# Altium project TeaNC.PrjPcb
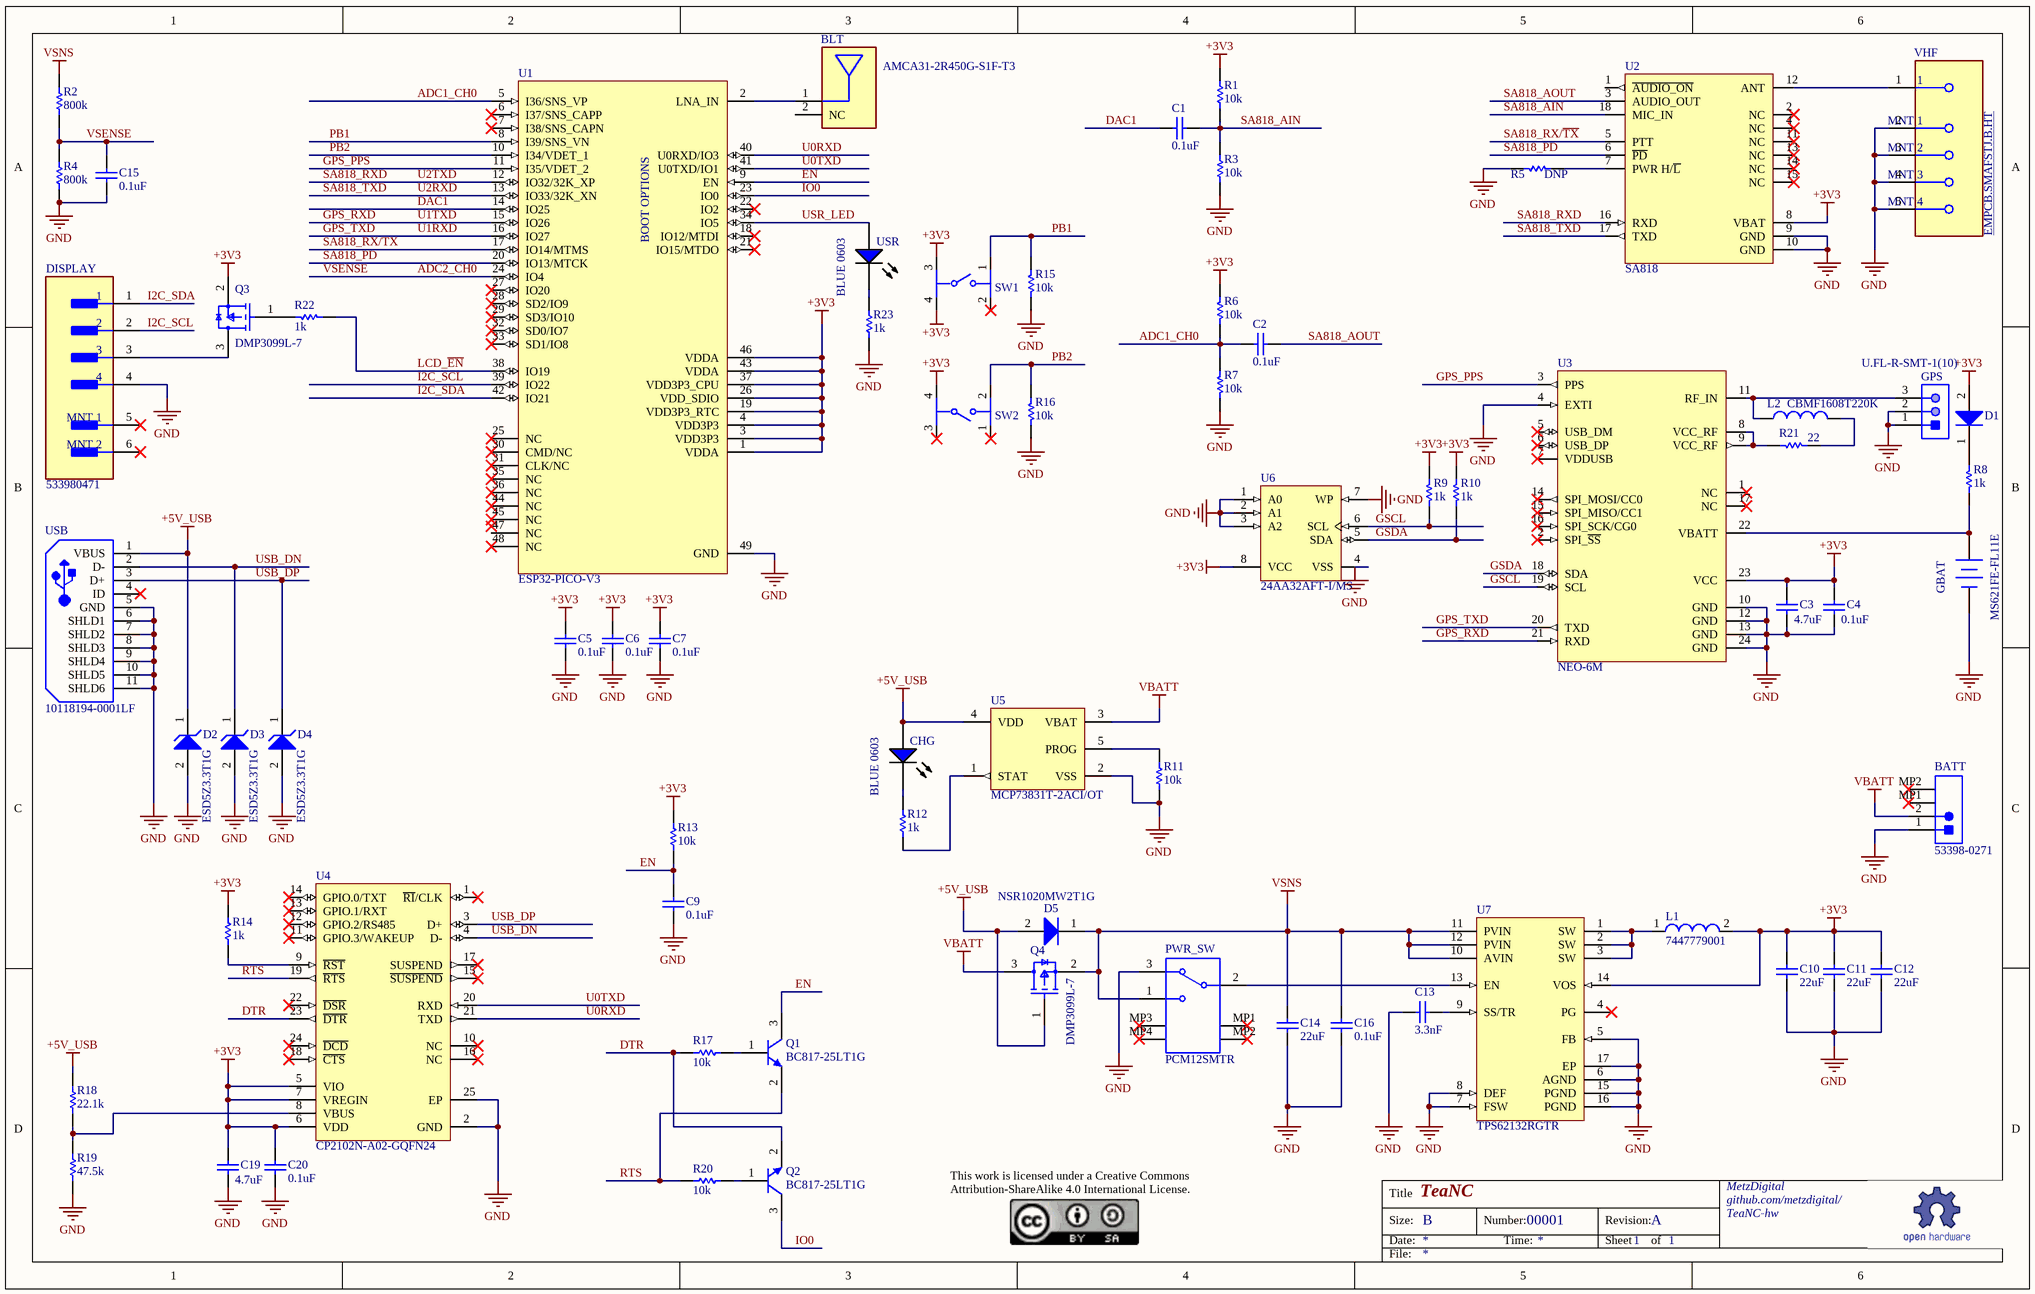
[diagram p0: top.SchDoc]
1 sheet, 70 parts. Net scope: global (net labels, ports and power ports of the same name join across sheets).
Board file: TeaNC.PcbDoc

## Sheet top.SchDoc: TeaNC
size B; Organization: MetzDigital; Address1: github.com/metzdigital/; Address2: TeaNC-hw; DocumentNumber: 00001; Revision: A; SheetNumber: 1; SheetTotal: 1

### Parts
BATT  53398-0271  [MOLX-53398-0271_V]
BLT  AMCA31-2R450G-S1F-T3  [FP-AMCA31-MFG]
C1  0.1uF  [CAPC0603(1608)100_M]
C2  0.1uF  [CAPC0603(1608)100_M]
C3  4.7uF  [CAPC0603(1608)100_M]
C4  0.1uF  [CAPC0603(1608)100_M]
C5  0.1uF  [CAPC0603(1608)100_M]
C6  0.1uF  [CAPC0603(1608)100_M]
C7  0.1uF  [CAPC0603(1608)100_M]
C9  0.1uF  [CAPC0603(1608)100_M]
C10  22uF  [CAPC1206(3216)190_M]
C11  22uF  [CAPC1206(3216)190_M]
C12  22uF  [CAPC1206(3216)190_M]
C13  3.3nF  [CAPC0603(1608)100_M]
C14  22uF  [CAPC1206(3216)190_M]
C15  0.1uF  [CAPC0603(1608)100_M]
C16  0.1uF  [CAPC0603(1608)100_M]
C19  4.7uF  [CAPC0603(1608)100_M]
C20  0.1uF  [CAPC0603(1608)100_M]
CHG  BLUE 0603  [VISH-TLMX1100-2_V]
D1  NSR1020MW2T1G  [ONSC-SOD-323-2-477-02_V]  (value not drawn)
D2  ESD5Z3.3T1G  [ONSC-SOD-523-2-502-01_V]
D3  ESD5Z3.3T1G  [ONSC-SOD-523-2-502-01_V]
D4  ESD5Z3.3T1G  [ONSC-SOD-523-2-502-01_V]
D5  NSR1020MW2T1G  [ONSC-SOD-323-2-477-02_V]
DISPLAY  533980471  [FP-533980471-MFG]
GBAT  MS621FE-FL11E  [SEIK-MS621FE-FL11E-2_V]
GPS  U.FL-R-SMT-1(10)  [HRS-U.FL-R-SMT-1(10)_V]
L1  7447779001  [WE-PD-M-PB]
L2  CBMF1608T220K  [INDC1608X90X30LL10T20]
PWR_SW  PCM12SMTR  [CKCP-PCM12SMTR_V]
Q1  BC817-25LT1G  [ONSC-SOT-23-3-318-08_V]
Q2  BC817-25LT1G  [ONSC-SOT-23-3-318-08_V]
Q3  DMP3099L-7  [FP-SOT23-MFG]
Q4  DMP3099L-7  [FP-SOT23-MFG]
R1  10k  [RESC1609X55X30LL15T15]
R2  800k  [RESC1609X55X30LL15T15]
R3  10k  [RESC1609X55X30LL15T15]
R4  800k  [RESC1609X55X30LL15T15]
R5  DNP  [RESC1609X55X30LL15T15]
R6  10k  [RESC1609X55X30LL15T15]
R7  10k  [RESC1609X55X30LL15T15]
R8  1k  [RESC1609X55X30LL15T15]
R9  1k  [RESC1609X55X30LL15T15]
R10  1k  [RESC1609X55X30LL15T15]
R11  10k  [RESC1609X55X30LL15T15]
R12  1k  [RESC1609X55X30LL15T15]
R13  10k  [RESC1609X55X30LL15T15]
R14  1k  [RESC1609X55X30LL15T15]
R15  10k  [RESC1609X55X30LL15T15]
R16  10k  [RESC1609X55X30LL15T15]
R17  10k  [RESC1609X55X30LL15T15]
R18  22.1k  [RESC1609X55X30LL15T15]
R19  47.5k  [RESC1609X55X30LL15T15]
R20  10k  [RESC1609X55X30LL15T15]
R21  22  [RESC1609X55X30LL15T15]
R22  1k  [RESC1609X55X30LL15T15]
R23  1k  [RESC1609X55X30LL15T15]
SW1  PTS840 GKP SMTR LFS  [FP-PTS840_GKP_SMTR_LFS-MFG]  (value not drawn)
SW2  PTS840 GKP SMTR LFS  [FP-PTS840_GKP_SMTR_LFS-MFG]  (value not drawn)
U1  ESP32-PICO-V3  [QFN_M 48 POS]
U2  SA818  [SA818]
U3  NEO-6M  [NEO-6M]
U4  CP2102N-A02-GQFN24  [SLAB-QFN-24-2550x2550TP_A_V]
U5  MCP73831T-2ACI/OT  [SOT-23-OT5_M]
U6  24AA32AFT-I/MS  [MSOP-MS8_N]
U7  TPS62132RGTR  [RGT0016C_V]
USB  10118194-0001LF  [FCI-10118194-0001LF-5_V]
USR  BLUE 0603  [VISH-TLMX1100-2_V]
VHF  EMPCB.SMAFSTJ.B.HT  [FP-EMPCB_SMAFSTJ_B_HT-MFG]

### Nets
+3V3: C3.2 C4.2 C5.2 C6.2 C7.2 C10.2 C11.2 C12.2 C19.2 C20.2 D1.2(A) L1.2 Q3.2(SOURCE) R1.2 R6.2 R9.2 R10.2 R13.1 R14.1 SW1.3 SW1.4 SW2.4 U1.1(VDDA) U1.3(VDD3P3) U1.4(VDD3P3) U1.19(VDD3P3_RTC) U1.26(VDD_SDIO) U1.37(VDD3P3_CPU) U1.43(VDDA) U1.46(VDDA) U2.8(VBAT) U3.23(VCC) U4.5(VIO) U4.6(VDD) U4.7(VREGIN) U6.8(VCC) U7.14(VOS)
+5V_USB: CHG.1(A) D2.1(K) D5.2(A) Q4.1(GATE) R18.1 U5.4(VDD) USB.1(VBUS)
GND: BATT.1 C3.1 C4.1 C5.1 C6.1 C7.1 C9.1 C10.1 C11.1 C12.1 C13.1 C14.1 C15.1 C16.1 C19.1 C20.1 D2.2(A) D3.2(A) D4.2(A) DISPLAY.4 GBAT.2(-) GPS.1 GPS.2 PWR_SW.3 R3.1 R4.1 R5.2 R7.1 R11.2 R15.1 R16.1 R19.2 R23.2 U1.49(GND) U2.9(GND) U2.10(GND) U3.4(EXTI) U3.10(GND) U3.12(GND) U3.13(GND) U3.24(GND) U4.2(GND) U4.25(EP) U5.2(VSS) U6.1(A0) U6.2(A1) U6.3(A2) U6.4(VSS) U6.7(WP) U7.5(FB) U7.6(AGND) U7.7(FSW) U7.8(DEF) U7.15(PGND) U7.16(PGND) U7.17(EP) USB.5(GND) USB.6(SHLD1) USB.7(SHLD2) USB.8(SHLD3) USB.9(SHLD4) USB.10(SHLD5) USB.11(SHLD6) VHF.2(MNT_1) VHF.3(MNT_2) VHF.4(MNT_3) VHF.5(MNT_4)
VBATT: BATT.2 Q4.3(DRAIN) U5.3(VBAT)
VSNS: C14.2 C16.2 D5.1(K) PWR_SW.1 Q4.2(SOURCE) R2.2 U7.10(AVIN) U7.11(PVIN) U7.12(PVIN)
ADC1_CH0: C2.1 R6.1 R7.2 U1.5(I36/SNS_VP)
ADC2_CH0: C15.2 R2.1 R4.2 U1.24(IO4)  [also labelled VSENSE]
DAC1: C1.2 U1.14(IO25)
DTR: Q2.2(E) R17.2 U4.23(~{DTR})
EN: C9.2 Q1.3(C) R13.2 U1.9(EN)
GPS_PPS: U1.11(I35/VDET_2) U3.3(PPS)
GPS_RXD: U1.15(IO26) U3.21(RXD)  [also labelled U1TXD]
GPS_TXD: U1.16(IO27) U3.20(TXD)  [also labelled U1RXD]
GSCL: R9.1 U3.19(SCL) U6.6(SCL)
GSDA: R10.1 U3.18(SDA) U6.5(SDA)
I2C_SCL: DISPLAY.2 U1.39(IO22)
I2C_SDA: DISPLAY.1 U1.42(IO21)
IO0: Q2.3(C) U1.23(IO0)
LCD_~{EN}: R22.1 U1.38(IO19)
PB1: R15.2 SW1.1 U1.8(I39/SNS_VN)
PB2: R16.2 SW2.2 U1.10(I34/VDET_1)
RTS: Q1.2(E) R20.2 U4.19(~{RTS})
SA818_AIN: C1.1 R1.1 R3.2 U2.18(MIC_IN)
SA818_AOUT: C2.2 U2.3(AUDIO_OUT)
SA818_PD: U1.20(IO13/MTCK) U2.6(~{PD})
SA818_RX/~{TX}: U1.17(IO14/MTMS) U2.5(PTT)
SA818_RXD: U1.12(IO32/32K_XP) U2.16(RXD)  [also labelled U2TXD]
SA818_TXD: U1.13(IO33/32K_XN) U2.17(TXD)  [also labelled U2RXD]
U0RXD: U1.40(U0RXD/IO3) U4.21(TXD)
U0TXD: U1.41(U0TXD/IO1) U4.20(RXD)
USB_DN: D3.1(K) U4.4(D-) USB.2(D-)
USB_DP: D4.1(K) U4.3(D+) USB.3(D+)
USR_LED: U1.34(IO5) USR.1(A)
NetBLT_1: BLT.1(Feed_Point) U1.2(LNA_IN)
NetC13_2: C13.2 U7.9(SS/TR)
NetCHG_2: CHG.2(K) R12.1
NetD1_1: D1.1(K) R8.2
NetDISPLAY_3: DISPLAY.3 Q3.3(DRAIN)
NetGBAT_1: GBAT.1(+) R8.1 U3.22(VBATT)
NetGPS_3: GPS.3 L2.1 U3.11(RF_IN)
NetL1_1: L1.1 U7.1(SW) U7.2(SW) U7.3(SW)
NetL2_2: L2.2 R21.2
NetPWR_SW_2: PWR_SW.2 U7.13(EN)
NetQ1_1: Q1.1(B) R17.1
NetQ2_1: Q2.1(B) R20.1
NetQ3_1: Q3.1(GATE) R22.2
NetR5_1: R5.1 U2.7(PWR_H/~{L})
NetR11_1: R11.1 U5.5(PROG)
NetR12_2: R12.2 U5.1(STAT)
NetR14_2: R14.2 U4.9(~{RST})
NetR18_2: R18.2 R19.1 U4.8(VBUS)
NetR21_1: R21.1 U3.8(VCC_RF) U3.9(VCC_RF)
NetR23_1: R23.1 USR.2(K)
NetU2_12: U2.12(ANT) VHF.1

Not connected (* = marked no-connect by the designer): BATT MP1* MP2*; BLT 2(NC); DISPLAY 5(MNT_1)* 6(MNT_2)*; PWR_SW MP1* MP2* MP3* MP4*; SW1 2*; SW2 1* 3*; U1 6(I37/SNS_CAPP)* 7(I38/SNS_CAPN)* 18(IO12/MTDI)* 21(IO15/MTDO)* 22(IO2)* 25(NC)* 27(IO20)* 28(SD2/IO9)* 29(SD3/IO10)* 30(CMD/NC)* 31(CLK/NC)* 32(SD0/IO7)* 33(SD1/IO8)* 35(NC)* 36(NC)* 44(NC)* 45(NC)* 47(NC) 48(NC)*; U2 1(~{AUDIO_ON}) 2(NC)* 4(NC)* 11(NC)* 13(NC)* 14(NC)* 15(NC)*; U3 1(NC)* 2(SPI_~{SS})* 5(USB_DM)* 6(USB_DP)* 7(VDDUSB)* 14(SPI_MOSI/CC0)* 15(SPI_MISO/CC1)* 16(SPI_SCK/CG0)* 17(NC)*; U4 1(~{RI}/CLK)* 10(NC)* 11(GPIO.3/WAKEUP)* 12(GPIO.2/RS485)* 13(GPIO.1/RXT)* 14(GPIO.0/TXT)* 15(~{SUSPEND})* 16(NC)* 17(SUSPEND)* 18(~{CTS})* 22(~{DSR})* 24(~{DCD})*; U7 4(PG)*; USB 4(ID)*

### Notes on the sheet
- This work is licensed under a Creative Commons Attribution-ShareAlike 4.0 International License.
- Title
- Size:
- Date:
- B
- Number:
- Time:
- Revision:
- Sheet
- of
- File:
- (in symbol ESP32-PICO-V3) BOOT OPTIONS

### Library data of the parts
BATT = CMP-2000-07600-1: Male Header, Pitch 1.25 mm, 1 x 2 Position, Height 4.7 mm, -40 to 85 degC, RoHS, Tape and Reel; Manufacturer: Molex; Voltage Rating: 125V; Glow Wire Compliant: Non-compliant; Pitch: 1.25mm; Number of Positions: 2; Contact Resistance: 20mOhm; Insulation Resistance: 100MOhm; Current Rating: 1A; Mounting Technology: SurfaceMount; Colour: Natural; Mount: SurfaceMount; Termination: Solder; Packaging: TapeandReel; REACH SVHC: Unknown; Voltage Rating (AC): 125V; Housing Colour: Natural; Manufacturer URL: http://www.molex.com/; Max Operating Temperature: 85degC; Gender: Male; Lead Free: LeadFree; RoHSCompliant: True; Contact Plating: Tin; Package Reference: 53398-0271; Contact Material: Tin; Orientation: Vertical; Datasheet URL: http://www.molex.com/pdm_docs/sd/533980271_sd.pdf; Working Voltage: 125V; Flammability Rating: UL94V-0; Number of Contacts: 2; Package Description: Male Header, Pitch 1.25 mm, 1 x 2 Position, Height 4.7 mm; Datasheet Version: Rev. J, 09/2015; Number of Circuits: 2; Number of Rows: 1; Radiation Hardening: No; Voltage Rating (DC): 125V; Min Operating Temperature: -40degC; Housing Material: Nylon; Package Quantity: 1000
BLT = CMP-27836-000002-1: RF ANT 2.4GHZ CHIP SOLDER SMD; Manufacturer: Abracon; Power Rating: 3W; Max Frequency: 2450MHz; Impedance: 50Ω; Number Of Bands: 1; Bandwidth: 100MHz; RoHS: TRUE; ComponentLink2Description: Datasheet; Category: Ant; Temperature: -40°C to +85°C; Device Class L3: RF Antennas; Octopart: https://octopart.com/amca31-2r450g-s1f-t3-abracon-31435383; Manufacturer Part Number: AMCA31-2R450G-S1F-T3; Digikey Description: RF ANT 2.4GHZ CHIP SOLDER SMD; Package: AMCA31; Temperature Range High: +85°C; Automotive: No; Device Class L2: RF Semiconductors and Devices; ComponentLink2URL: https://abracon.com/chip-antenna/AMCA31-2R450G-S1F-T3.pdf; Temperature Range Low: -40°C; Device Class L1: Integrated Circuits (ICs); Lead Free: Yes; Height: 1.4mm; Mouser Description: Antennas 2.45GHz BW 90dB + Gain -1 dBi avg.
C1-C7 C9 C13 C15 C16 C19 C20 = CMP-1035-02593-1: CAP 100nF 50V ±20% 0603 (1608 Metric) Thickness 1mm SMD; Tolerance: Â±20%; Case-EIA: 0603; Case-Metric: 1608; Max Thickness: 1 mm; Value: 100nF; Technology: SMT; Rated Voltage: 50 V
C10-C12 C14 = CMP-1037-04728-1: CAP 1uF 100V ±10% 1206 (3216 Metric) Thickness 1.9mm SMD; Case-EIA: 1206; Case-Metric: 3216; Tolerance: Â±10%; Value: 1uF; Rated Voltage: 100 V; Technology: SMT; Max Thickness: 1.9 mm
CHG USR = CMP-1666-00028-1: Blue LED, 10 mA, 3.9 V, -40 to 100 degC, 2-Pin SMD (0603), RoHS, Tape and Reel; Tolerance: 10%; Voltage Rating: 100 V; Capacitance: 10 nF; Type (Capacitors): X7R; Case\Package: Radial; ComponentLink1Description: Manufacturer URL; REACH SVHC: No SVHC; Package Quantity: 500; PackageDescription: 2-Pin Surface Mount Device, Body 1.6 x 0.8 mm; Pins: 2; ComponentLink2URL: http://download.siliconexpert.com/pdfs/2016/8/7/12/43/26/667/vsh_/manual/379263299541529tlmb1100.pdf; RoHSCompliant: true; Lead Pitch: 2.54 mm; Height: 2.54 mm; DatasheetVersion: Rev. 2.7, 03/2016; Length: 5.33 mm; ComponentLink1URL: http://www.vishay.com/; Min Operating Temperature: -55 degC; PackageReference: 0603; Packaging: Bulk; ComponentLink2Description: Datasheet; Max Operating Temperature: 125 degC; Radiation Hardening: No; Width: 3.81 mm; Mount: Through Hole
D1 D5 = CMP-1055-00471-1: Schottky Barrier Diode, 2-Pin SOD-323, Pb-Free, Tape and Reel; Manufacturer: On Semiconductor; IFSM Max (A): 5; Configuration: Single; ComponentLink2URL: http://www.onsemi.cn/pub_link/Collateral/NSR1020MW2T1-D.PDF; PackageDescription: 2-Pin SOD, Body 1.7 x 1.25 mm; ComponentLink3Description: Package Specification; RoHS: TRUE; PackageReference: SOD-323-2-477-02; PackageVersion: Rev. H, 03/2007; Mounting Technology: Surface Mount; DatasheetVersion: Rev. 1; ComponentLink1URL: http://www.onsemi.com/; PartNumber: NSR1020MW2T1G; Packing: Tape and Reel; ComponentLink1Description: Manufacturer URL; ComponentLink2Description: Datasheet; ComponentLink3URL: http://www.onsemi.com/pub_link/Collateral/477-02.PDF.1
D2-D4 = CMP-1063-00098-1: Transient Voltage Suppressor, Micro-Packaged Diode for ESD Protection, 2-Pin SOD-523, Pb-Free, Tape and Reel; Manufacturer: On Semiconductor; VRWM Max (V): 3.3; Number of Lines: 1; V(BR) Min (V): 5; PPK Max (W): 158; Direction: Unidirectional; IR Max (uA): 0.05; PackageReference: SOD-523-2-502-01; PackageVersion: Rev. E, 09/2010; RoHS: Pb-Free; ComponentLink3Description: Package Specification; Packing: Tape and Reel; ComponentLink1URL: http://www.onsemi.com/; DatasheetVersion: Rev. 10; ComponentLink2Description: Datasheet; Mounting Technology: Surface Mount; ComponentLink2URL: http://www.onsemi.cn/pub_link/Collateral/ESD5Z2.5T1-D.PDF; PartNumber: ESD5Z3.3T1G; PackageDescription: 2-Pin SOD, Body 1.2 x 0.8 mm; ComponentLink3URL: http://www.onsemi.com/pub_link/Collateral/502-01.PDF; ComponentLink1Description: Manufacturer URL
DISPLAY = CMP-04776-000105-1: CONN HEADER SMD 4POS 1.25MM; Manufacturer: Molex; Conn Gender: Male; Conn Orientation: Vertical; Standoff Height: 0.05mm; Number Of Contacts: 4; Current Rating: 1A; Voltage Rating: 125V; Package: 0; ComponentLink2Description: Datasheet; ComponentLink2URL: https://www.molex.com/pdm_docs/ps/PS-51021-024-001.pdf; Ambient Temperature Range Low: -40°C; Category: Conn; Automotive: No; Number Of Rows: 1; Device Class L3: unset; Ambient Temperature Range High: +105°C; Height: 5.1mm; Lead Free: Yes; Pitch: 1.25mm; Contact Material: Tin; Footprint Url: https://www.molex.com/pdm_docs/sd/533980471_sd.pdf; Octopart: https://octopart.com/53398-0471-molex-655296; Temperature Range Low: -40°C; Device Class L2: Headers and Wire Housings; Temperature: -40°C to +105°C; Digikey Description: CONN HEADER SMD 4POS 1.25MM; RoHS: TRUE; Manufacturer Part Number: 533980471; Device Class L1: Connectors; Temperature Range High: +105°C
GBAT = CMP-2000-05342-1: MS Lihium Rechargeable Battery, 3 V, -20 to 60 degC, Tray; Manufacturer: SeikoInstruments; Brand: SeikoInstrumentsMicroEnergy; Output Voltage: 3V; Capacity: 5.5mAh; Chemistry: Lithium; Battery Size: 621; Unit Weight: 0.008113oz; Datasheet URL: http://datasheet.octopart.com/MS621FE-FL11E-Seiko-datasheet-5320152.pdf; Rechargeable/Non-Rechargeable: Rechargeable; Orientation: Vertical; Height: 2.1mm; Series: MS; Datasheet Version: Jan-08; Type: CoinCellBatterywithLeads; Diameter: 6.8mm; Mounting Style: WithLeads; Product Category: CoinCellBattery; Termination Style: ThroughHole; Packaging: Tray; Manufacturer URL: http://www.sii.co.jp/en/; RoHS: NotApplicable; Factory Pack Quantity: 100
GPS = CMP-2000-05152-1: Ultra Small Surface Mount Coaxial Connector, -40 to 90 degC, 2-Pin SMT, RoHS, Tape and Reel; Manufacturer: Hirose Electric; Connector Style: U.FL,UltraMiniatureCoaxial; Center Contact Plating: Gold; Body Material: PhosphorBronze; Center Contact Material: Brass; Body Finish: Silver; Frequency - Max: 6GHz; Shield Termination: Solder; Impedance: 50Ohm; Online Catalog: UMCC(UltraMiniatureCoaxConnectors),U.FLSeries; Other Names: H11891TRQ5400621U.FL-R-SMT-110U.FL-R-SMT-1(10)-NDUFLRSMT110; Featured Product: U.FLSeriesConnectors; Connector Type: Receptacle,MalePin; Dielectric Material: LiquidCrystalPolymer(LCP); Fastening Type: Snap-On; Features: -; Operating Temperature: -40degC~90degC; Mounting Type: SurfaceMount; Ingress Protection: -; Packaging: Tape&Reel(TR); Datasheet Version: Feb-04; Category: Connectors,Interconnects; Housing Color: Beige; Manufacturer URL: https://www.hirose.com; Series: U.FL; Contact Termination: Solder; Datasheet URL: http://www.farnell.com/datasheets/91524.pdf; Cable Group: -; Family: CoaxialConnectors(RF); Standard Package: 2,500; Voltage Rating: -
L1 = CMP-0227-00302-1: SMD-Shielded Power Inductor WE-PD, L = 1.00 µH; Inductance: 1.00 ÂµH; DatasheetVersion: ver 10, Jan-2008; PackageDescription: SMD Inductor, 2-Leads, Body 7.3 x 7.3 mm; ComponentLink2URL: http://www.we-online.de/katalog/media/pdf/7447779001.pdf; PackageVersion: 2008; ComponentLink1Description: Manufacturer Link; PackageReference: WE-PD-M-PB; ComponentLink2Description: Datasheet; ComponentLink1URL: http://www.we-online.com
L2 = CMP-2000-05913-1: Unshielded Wirewound Inductor, 33 nH, 350 mA, -55 to 150 degC, 0603 (1608 Metric), RoHS, Tape and Reel; Manufacturer: EPCOS-(TDK); Manufacturer 1: Taiyo Yuden; Q @ Freq: 14@100MHz; Inductance: 33nH; Material - Core: Ceramic; Frequency - Self Resonant: 3GHz; DC Resistance (DCR): 600mOhmMax; Tolerance: ±5%; Frequency - Test: 100MHz; Current Rating: 350mA; Core Material: Ferrite; Self Resonant Frequency: 16MHz; Test Frequency: 2.52MHz; Max DC Current: 230mA; Inductance Tolerance: 10%; Saturation Current: 70mA; Manufacturer URL: http://www.tdk.com/; Type: Wirewound; Mounting Type: SurfaceMount; Mounting Technology: SurfaceMount; Height - Seated (Max): 0.035"(0.90mm); Datasheet URL: https://en.tdk.eu/inf/30/db/ind_2008/b82496c.pdf; Shielding: Unshielded; Operating Temperature: -; Size / Dimension: 0.063"Lx0.031"W(1.60mmx0.80mm); Series: SIMID; Current - Saturation: -; Ratings: AEC-Q200; Packaging: CutTape(CT); Package Reference: 0603; Datasheet Version: 07/2016; Category: Inductors,Coils,Chokes; Package Description: 2-Pin Surface Mount Device, Body 1.6 x 0.8 mm; Family: FixedInductors; Package / Case: 0603(1608Metric); Supplier 1: Digi-Key; Supplier Part Number 1: 587-1721-1-ND; Manufacturer Part Number 1: CBMF1608T220K; Stock 1: 23426; Pricing 1: 1=0.23000, 10=0.20800, 25=0.18200, 50=0.15600, 100=0.14300, 250=0.13000, 500=0.12220, 1000=0.09360 (USD); RoHS: Yes; Mount: Surface Mount; Case/Package: 0603; Weight: 7.1E-05oz; Case Code (Imperial): 0603; Case Code (Metric): 1608; Min Operating Temperature: -40°C; Max Operating Temperature: 105°C; Package Quantity: 3000; Termination: SMD/SMT; Resistor Type: Wirewound; DC Current: 230mA; Length: 0.063inch; Height: 0.8mm; Width: 0.031inch; Depth: 1mm; Radiation Hardening: No; REACH SVHC: Unknown; Lead Free: Lead Free; Halogen Free: Halogen Free; Military Standard: Not; ComponentLink1URL: https://datasheet.ciiva.com/15981/800cbmf1608t220k-15981678.pdf?src-supplier=Onlinecomponents.com; ComponentLink1Description: https://datasheet.ciiva.com/15981/800cbmf1608t220k-15981678.pdf?src-supplier=Onlinecomponents.com; ComponentLink2URL: https://datasheet.ciiva.com/1040/cbmf1608t220k-ss-1040614.pdf?src-supplier=Digi-Key; ComponentLink2Description: https://datasheet.ciiva.com/1040/cbmf1608t220k-ss-1040614.pdf?src-supplier=Digi-Key; ComponentLink3URL: https://datasheet.ciiva.com/8505/cbmf1608t220k-ss-8505638.pdf?src-supplier=Avnet; ComponentLink3Description: https://datasheet.ciiva.com/8505/cbmf1608t220k-ss-8505638.pdf?src-supplier=Avnet; ComponentLink4URL: https://datasheet.ciiva.com/26871/getdatasheetpartid-639477-26871197.pdf?src-supplier=Verical; ComponentLink4Description: https://datasheet.ciiva.com/26871/getdatasheetpartid-639477-26871197.pdf?src-supplier=Verical; ComponentLink5URL: https://datasheet.ciiva.com/8001/wound02-e-8001895.pdf?src-supplier=Element14; ComponentLink5Description: https://datasheet.ciiva.com/8001/wound02-e-8001895.pdf?src-supplier=Element14
PWR_SW = CMP-2000-06884-1: Ultraminiature Slide Switch, SPDT, 0.3 A, 6 V, -20 to 85 degC, 3-Pin SMD, RoHS, Tape and Reel; Manufacturer: C&K Components; Switch Operation: On-On; Contact Current-Max: 0.3A; Datasheet Version: 02/2016; Package Reference: PCM12SMTR; Package Description: 3-Pin Surface Mount Device, Body 6.7 x 2.6 mm; Contact Material: SilverOverCopper; Mounting Technology: SurfaceMount; Circuitry: SPDT; Datasheet URL: http://www.ck-components.com/media/1424/pcm.pdf; Termination Style: RightAngle/SurfaceMount; Manufacturer URL: http://www.ckswitches.com/
Q1 Q2 = CMP-1048-00737-1: General Purpose Transistor, NPN Silicon, 3-Pin SOT-23, Pb-Free, Tape and Reel; Manufacturer: On Semiconductor; IC Continuous (A): 0.5; fT Min (MHz): 100; PackageDescription: 3-Pin Small Outline Transistor, Body 2.92 x 1.3 mm, Pitch 0.95 mm; ComponentLink3Description: Package Specification; ComponentLink2Description: Datasheet; RoHS: TRUE; PackageVersion: Rev. AP, 11/2009; ComponentLink1URL: http://www.onsemi.com/; PackageReference: SOT-23-3-318-08; ComponentLink3URL: http://www.onsemi.cn/pub_link/Collateral/318-08.PDF; ComponentLink2URL: http://www.onsemi.com/pub_link/Collateral/BC817-16LT1-D.PDF; Mounting Technology: Surface Mount; Packing: Tape and Reel; DatasheetVersion: Rev. 12; Polarity: NPN; PartNumber: BC817-25LT1G; ComponentLink1Description: Manufacturer URL
Q3 Q4 = CMP-12801-000062-1: MOSFET P-CH 30V SOT23; Manufacturer: Diodes Inc.; Drain To Source Voltage: -30V; Depletion Mode: False; Standoff Height: 0.013mm; Turn Off Delay Time: 31ns; Turn On Delay Time: 4.8ns; Max Forward Diode Voltage: -1.26V; Automotive Grade: Grade 0; Number Of P Channels: 1; Threshold Vgs Min: -1V; Continuous Drain Current: -3.8A; Drain To Source Resistance: 65mΩ; Gate Charge At Vgs: 5.2nC @ -4.5V; Pulse Drain Current: -11A; Power Dissipation: 1.08W; Max Junction Temp: +150°C; Rthja Max: 115°C/W; Threshold Vgs Max: -2.1V; Input Capacitace At Vds: 563pF @ -25V; Gate To Source Voltage: 20V; Temperature Range High: +150°C; Drain To Source Breakdown Voltage: -30V; ComponentLink2Description: Datasheet; Temperature Range Low: -55°C; Automotive: Yes; Category: Trans; Number Of Channels: 1; ComponentLink2URL: https://www.diodes.com/assets/Datasheets/DMP3099L.pdf; Temperature: -55°C to +150°C; Device Class L3: MOSFETs; Footprint Url: https://www.diodes.com/assets/Package-Files/SOT23.pdf; Manufacturer Part Number: DMP3099L-7; Digikey Description: MOSFET P-CH 30V SOT23; Octopart: https://octopart.com/dmp3099l-7-diodes+inc.-30954908; Lead Free: Yes; RoHS: TRUE; Mouser Description: MOSFET P-Ch ENH FET -30V 65mOhm -10V -3.8A; Package: SOT23; Device Class L1: Discrete Semiconductors; Device Class L2: Transistors; Height: 1.1mm
R1-R23 = CMP-2000-07452-1: Chip Resistor, 10 KOhm, +/- 1%, 0.1 W, -55 to 155 degC, 0603 (1608 Metric), RoHS, Tape and Reel; Manufacturer: Panasonic; Voltage Rating: 75V; Case\/Package: 0603; Power Rating: 100mW; Resistance: 10KOhm; Temperature Coefficient: 100ppm\/degreesC; Number of Pins: 2; Package Reference: 603; Depth: 0.8mm; Mount: SurfaceMount; Package Description: 2-Pin Surface Mount Device, Body 1.6 x 0.85 mm; Datasheet Version: 02/2017; Length: 1.6mm; Lead Free: LeadFree; Height: 0.45mm; Number of Terminations: 2; Max Power Dissipation: 100mW; Min Operating Temperature: -55degC; Datasheet URL: https://industrial.panasonic.com/cdbs/www-data/pdf/RDA0000/AOA0000C304.pdf; Termination: SMD/SMT; Case Code (Metric): 1608; Case Code (Imperial): 0603; Tolerance: 1%; Max Operating Temperature: 155degC; RoHSCompliant: true; Voltage Rating (DC): 75V; Radiation Hardening: No; Packaging: TapeandReel; Composition: ThickFilm; Mounting Technology: SurfaceMount; Manufacturer URL: http://www.panasonic.com/; Width: 0.031inch; REACH SVHC: NoSVHC; Contact Plating: Tin; Military Standard: Not; Package Quantity: 1
SW1 SW2 = CMP-10040-000012-1: SWITCH TACTILE SPST-NO 0.05A 12V; Manufacturer: C&K Components; Electromechanical Life: 100000Cycles; Contact Current Rating: 50mA; Operating Force: 220gf; Standoff Height: 0mm; Contact Resistance: 500mΩ; Temperature Range High: +85°C; Automotive: No; Height: 1.35mm; Lead Free: Yes; Device Class L1: Electromechanical; Temperature: -40°C to +85°C; Digikey Description: SWITCH TACTILE SPST-NO 0.05A 12V; ComponentLink2Description: Datasheet; Category: Switch; Temperature Range Low: -40°C; Manufacturer Part Number: PTS840 GKP SMTR LFS; Throw Configuration: SPST-NO; Package: PTS840 GKP SMTR LFS; Device Class L2: Switches; Mouser Description: Tactile Switches; Voltage Rating Dc: 12V; ComponentLink2URL: https://www.ckswitches.com/media/1477/pts840.pdf; Octopart: https://octopart.com/pts840gkpsmtrlfs-c%26k+components-29380303; Device Class L3: Tactile Switches; RoHS: TRUE
U1 = ESP32-PICO-V3: ESP32 WIFI BLUETOOTH MCU
U2 = SA818: 1W Embedded Small Size Walkie Talkie
U3 = NEO-6M: NEO-6 series of GPS module
U4 = CMP-2000-07570-1: USBXpress(TM) Family, 4 GPIOs, 2.2 to 3.6 V, -40 to 85 degC, 24-Pin QFN, RoHS; Manufacturer: Silicon Labs; Max Supply Voltage: 3.6V; Min Supply Voltage: 3V; Datasheet Version: Rev. 1.1, 08/2016; Max Operating Temperature: 85degC; Case\/Package: QFN; Number of Pins: 24; Min Operating Temperature: -40degC; Mounting Technology: SurfaceMount; Manufacturer URL: http://www.silabs.com/; RoHSCompliant: False; Package Reference: QFN-24-2550x2550TP_A; Datasheet URL: http://www.silabs.com/documents/public/data-sheets/cp2102n-datasheet.pdf; Package Description: 24-Pin Quad Flat No-lead Package, Body 4 x 4 mm, Pitch 0.5 mm; REACH SVHC: Unknown
U5 = CMP-0133-00143-1: Miniature Single-Cell, Fully Integrated Li-Ion, Li-Polymer Charge Management Controller, 4.2V, 5-Pin SOT-23, Industrial Temperature, Tape and Reel; PackageReference: SOT-23-OT5; PackageDescription: 5-Lead Plastic Small Outline Transistor (OT) [SOT-23]; PackageVersion: revBB, Aug-2009; DatasheetVersion: revE, Sep-2008; Code_IPC: SOT23-5
U6 = CMP-0159-00833-1: 32Kbit, 400kHz, 1.7V, I2C Serial EEPROM with half-array write-protect, 8-Pin MSOP, Industrial Temperature, Tape and Reel; PackageVersion: revBB, Aug-2009; PackageDescription: 8-Lead Plastic Micro Small Outline Package (MS) [MSOP]; PackageReference: MSOP-MS8; DatasheetVersion: revA, May-2009
U7 = CMP-0323-00152-3: Buck Step Down Regulator with 3 to 17 V Input and 3.3 V Output, -40 to 85 degC, 16-Pin QFN (RGT), Green (RoHS & no Sb/Br); Manufacturer: Texas Instruments; Switch Current Limit(Typ)(A): 4.2; Vout(Max)(V): 3.3; Iout(Max)(A): 3; Regulated Outputs(#): 1; Rating: Catalog; Vin(Max)(V): 17; Synchronous Rectification: TRUE; SubFamily: Step-Down Regulator; Duty Cycle(Max)(%): 100; Iq(Typ)(mA): 0.017; DatasheetVersion: SLVSAG7; ComponentLink3Description: URL Link1; PartNumber: TPS62132RGTR; ComponentLink1Description: Datasheet; Vin(Min)(V): 3; PackageDescription: 16-Pin Plastic Quad Flat No-Lead, 3 x 3 mm Body, 0.5 mm Pitch, 1.7 x 1.7 mm Exposed Pad; Mounting Technology: Surface Mount; Preset Vout(V): 3.3; Code_JEDEC: MO-220; ComponentLink1URL: http://www.ti.com/general/docs/lit/getliterature.tsp?genericPartNumber=TPS62132&fileType=pdf; Vout(Min)(V): 3.3; Eco-Plan: Green (RoHS & no Sb/Br); ComponentLink2URL: http://www.ti.com/litv/pdf/mpqf119g; ComponentLink2Description: Package Specification; PackageReference: RGT0016C; PackageVersion: revH, Oct-2011; Topology: Buck; ComponentLink3URL: Samples URL:http://www.ti.com/product/tps62132#samples
USB = CMP-2000-05120-1: Micro USB B Type Receptacle, 1.8 A, -55 to 85 degC, 5-Pin SMD, RoHS, Tape and Reel; Manufacturer: Amphenol FCI; Body Orientation: RightAngle; Number of Contacts: 5; Pitch: 0.65mm; Gender: RCP; Rad Hard: No; Package Reference: 10118194-0001LF-5; Mounting: SurfaceMount; Manufacturer URL: http://www.fci.com/; Packaging: CutTape; Datasheet URL: https://datasheet.ciiva.com/26945/getdatasheetpartid-418619-26945695.pdf; Termination Method: Solder; Package Description: 5-Pin Surface Mount Device, Body 8.05 x 5.53 mm, Pitch 0.65 mm; Type: MicroUSBTypeB; Datasheet Version: Rev. A, 10/2011
VHF = CMP-111093-000001-1: CONN SMA JACK STR 50OHM EDGE MNT; Manufacturer: Taoglas Limited; Conn Orientation: Horizontal; Frequency: 12.4GHz; Impedance: 50Ω; Voltage Rating: 335V; Is Female: yes; Pitch: 2.62mm; Number Of Contacts: 1; Device Class L2: RF / Coaxial Connectors; Category: Conn; Contact Material: Gold; Device Class L1: Connectors; Digikey Description: CONN SMA JACK STR 50OHM EDGE MNT; Temperature Range Low: -40°C; Octopart: https://octopart.com/empcb.smafstj.b.ht-taoglas-24204431; ComponentLink2URL: https://cdn.taoglas.com/datasheets/EMPCB.SMAFSTJ.B.HT.pdf; Temperature Range High: +85°C; Device Class L3: unset; Temperature: -40°C to +85°C; Package: 0; RoHS: TRUE; Lead Free: Yes; Automotive: No; ComponentLink2Description: Datasheet; Mouser Description: RF Connectors / Coaxial Connectors SMA Straight Edge Mount PCB Jack-Gold; Manufacturer Part Number: EMPCB.SMAFSTJ.B.HT